# EAGLE design Driver6a (EAGLE 7.1.0)
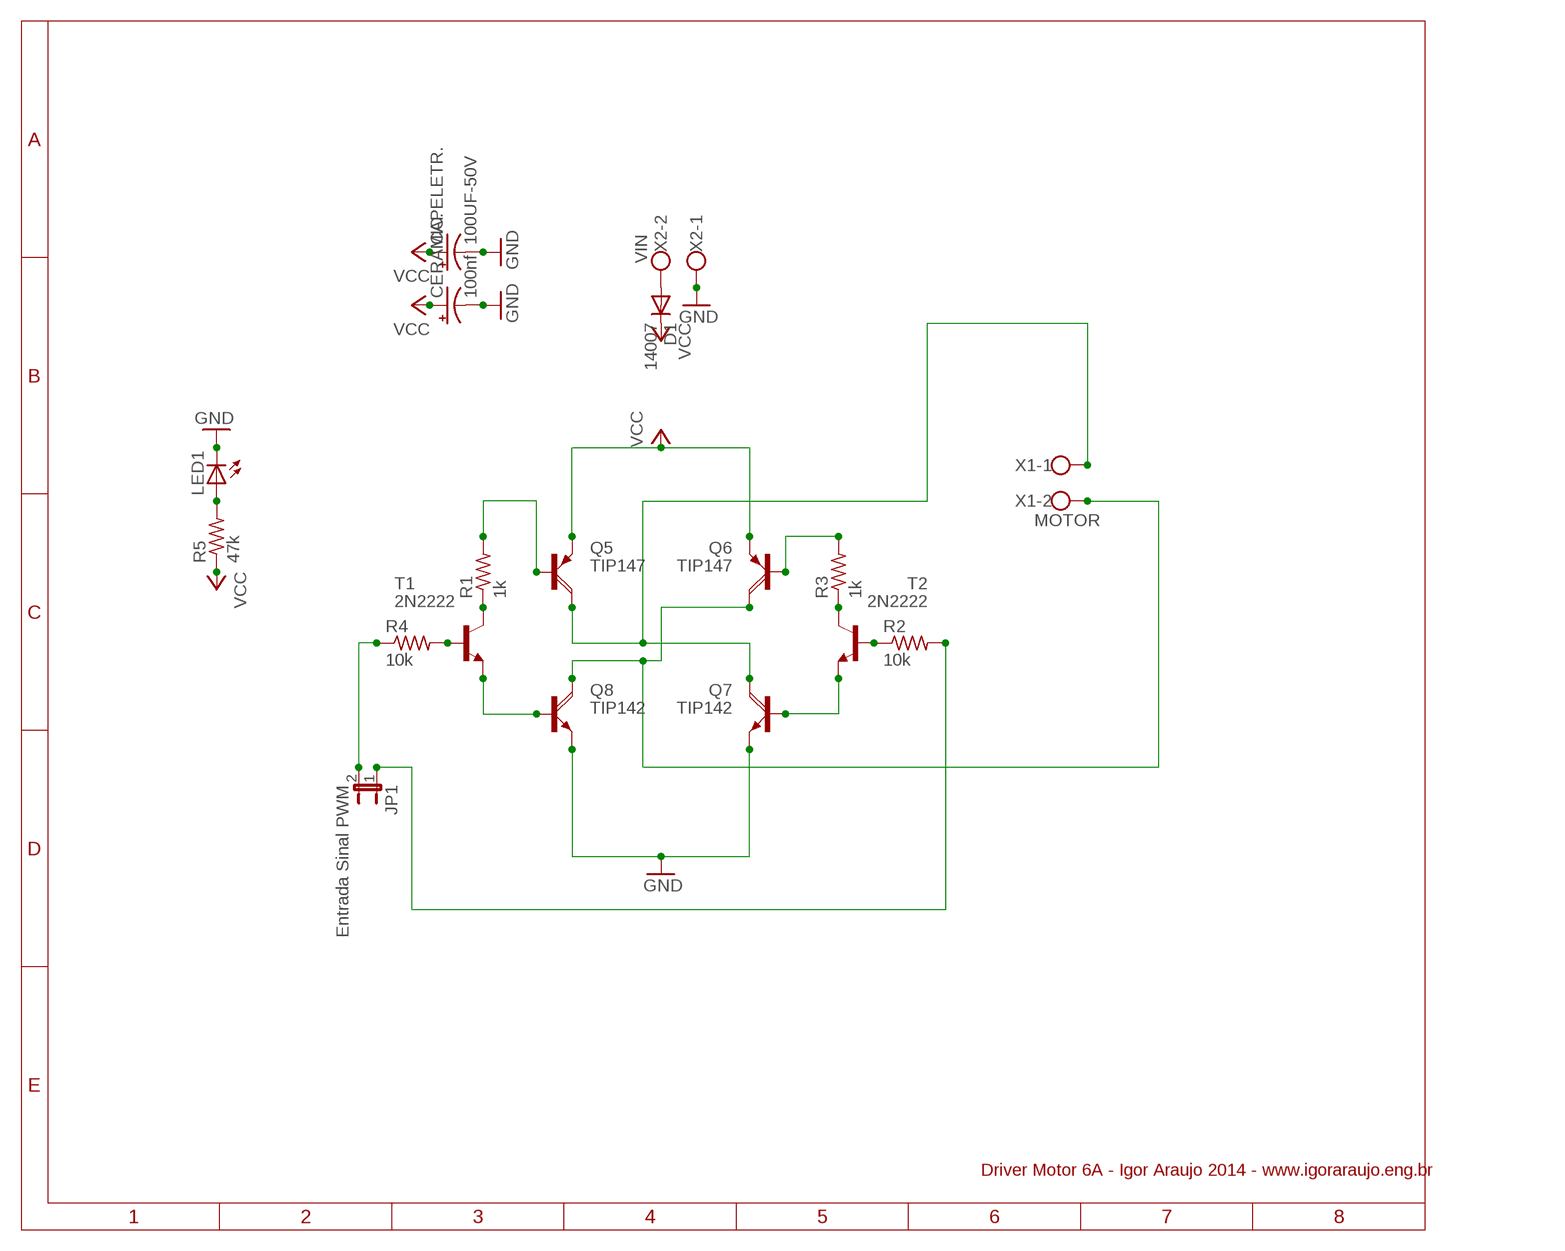
[diagram p0: schematic, sheet 1]

## Parts
CAPELETR.  100UF-50V  CPOL-USE3.5-8  [E3,5-8]
CERAMIC.  100nf  CPOL-USE3.5-8  [E3,5-8]
D1  14007  1N4148DO35-7  [DO35-7]
JP1  Entrada Sinal PWM  JP1E  [JP1]
LED1  LED3MM  [LED3MM]
Q5  TIP147  TIP125  [TO220AH]
Q6  TIP147  TIP125  [TO220AH]
Q7  TIP142  TIP120  [TO220AH]
Q8  TIP142  TIP120  [TO220AH]
R1  1k  R-US_0207/10  [0207/10]
R2  10k  R-US_0207/10  [0207/10]
R3  1k  R-US_0207/10  [0207/10]
R4  10k  R-US_0207/10  [0207/10]
R5  47k  R-US_0207/10  [0207/10]
T1  2N2222  [TO18]
T2  2N2222  [TO18]
X1  MOTOR  W237-02P  [W237-132]
X2  VIN  W237-02P  [W237-132]

## Nets
GND: CAPELETR..- CERAMIC..- LED1.K(C) Q7.E Q8.E X2.1
N$1: Q5.C Q7.C X1.1
N$2: Q6.C Q8.C X1.2
N$3: R1.1 T1.3(C)
N$4: Q5.B R1.2
N$5: Q8.B T1.1(E)
N$6: R3.1 T2.3(C)
N$7: Q6.B R3.2
N$8: Q7.B T2.1(E)
N$9: R2.1 T2.2(B)
N$10: R4.2 T1.2(B)
N$11: JP1.2 R4.1
N$12: JP1.1 R2.2
N$15: LED1.A R5.2
N$16: D1.A X2.2
VCC: CAPELETR..+ CERAMIC..+ D1.C Q5.E Q6.E R5.1

## Notes on the sheet
- Driver Motor 6A - Igor Araujo 2014 - www.igoraraujo.eng.br

## Library data of the parts
CAPELETR. CERAMIC. = rcl:CPOL-US: POLARIZED CAPACITOR, American symbol
D1 = diode:1N4148: DIODE high speed (Philips)
JP1 = jumper:JP1E: JUMPER
LED1 = led:LED: LED OSRAM: - CHIPLED LG R971, LG N971, LY N971, LG Q971, LY Q971, LO R971, LY R971 LH N974, LH R974 LS Q976, LO Q976, LY Q976 LO Q996 - Hyper CHIPLED LW Q18S LB Q993, LB Q99A, LB R99A - SideLED LS A670, LO A670, LY A670, LG A670, LP A670 LB A673, LV A673, LT A673, LW A673 LH A674 LY A675 LS A676, LA A676, LO A676, LY A676, LW A676 LS A679, LY A679, LG A679 - Hyper Micro SIDELED® LS Y876, LA Y876, LO Y876, LY Y876 LT Y87S - SmartLED LW L88C, LW L88S LB L89C, LB L89S, LG L890 LS L89K, LO L89K, LY L89K LS L896, LA L896, LO L896, LY L896 - TOPLED LS T670, LO T670, LY T670, LG T670, LP T670 LSG T670, LSP T670, LSY T670, LOP T670, LYG T670 LG T671, LOG T671, LSG T671 LB T673, LV T673, LT T673, LW T673 LH T674 LS T676, LA T676, LO T676, LY T676, LB T676, LH T676, LSB T676, LW T676 LB T67C, LV T67C, LT T67C, LS T67K, LO T67K, LY T67K, LW E67C LS E67B, LA E67B, LO E67B, LY E67B, LB E67C, LV E67C, LT E67C LW T67C LS T679, LY T679, LG T679 LS T770, LO T770, LY T770, LG T770, LP T770 LB T773, LV T773, LT T773, LW T773 LH T774 LS E675, LA E675, LY E675, LS T675 LS T776, LA T776, LO T776, LY T776, LB T776 LHGB T686 LT T68C, LB T68C - Hyper Mini TOPLED® LB M676 - Mini TOPLED Santana® LG M470 LS M47K, LO M47K, LY M47K Source: http://www.osram.convergy.de LUXEON: - LUMILED® LXK2-PW12-R00, LXK2-PW12-S00, LXK2-PW14-U00, LXK2-PW14-V00 LXK2-PM12-R00, LXK2-PM12-S00, LXK2-PM14-U00 LXK2-PE12-Q00, LXK2-PE12-R00, LXK2-PE12-S00, LXK2-PE14-T00, LXK2-PE14-U00 LXK2-PB12-K00, LXK2-PB12-L00, LXK2-PB12-M00, LXK2-PB14-N00, LXK2-PB14-P00, LXK2-PB14-Q00 LXK2-PR12-L00, LXK2-PR12-M00, LXK2-PR14-Q00, LXK2-PR14-R00 LXK2-PD12-Q00, LXK2-PD12-R00, LXK2-PD12-S00 LXK2-PH12-R00, LXK2-PH12-S00 LXK2-PL12-P00, LXK2-PL12-Q00, LXK2-PL12-R00 Source: www.luxeon.com KINGBRIGHT: KA-3528ASYC Source: www.kingbright.com
Q5 Q6 = transistor-power:TIP125: PNP DARLINGTON TRANSISTOR
Q7 Q8 = transistor-power:TIP120: NPN DARLINGTON TRANSISTOR
R1-R5 = rcl:R-US_: RESISTOR, American symbol
T1 T2 = transistor:2N2222: NPN TRANSISTOR
X1 X2 = con-wago-508:W237-02P: WAGO SREW CLAMP

## Board
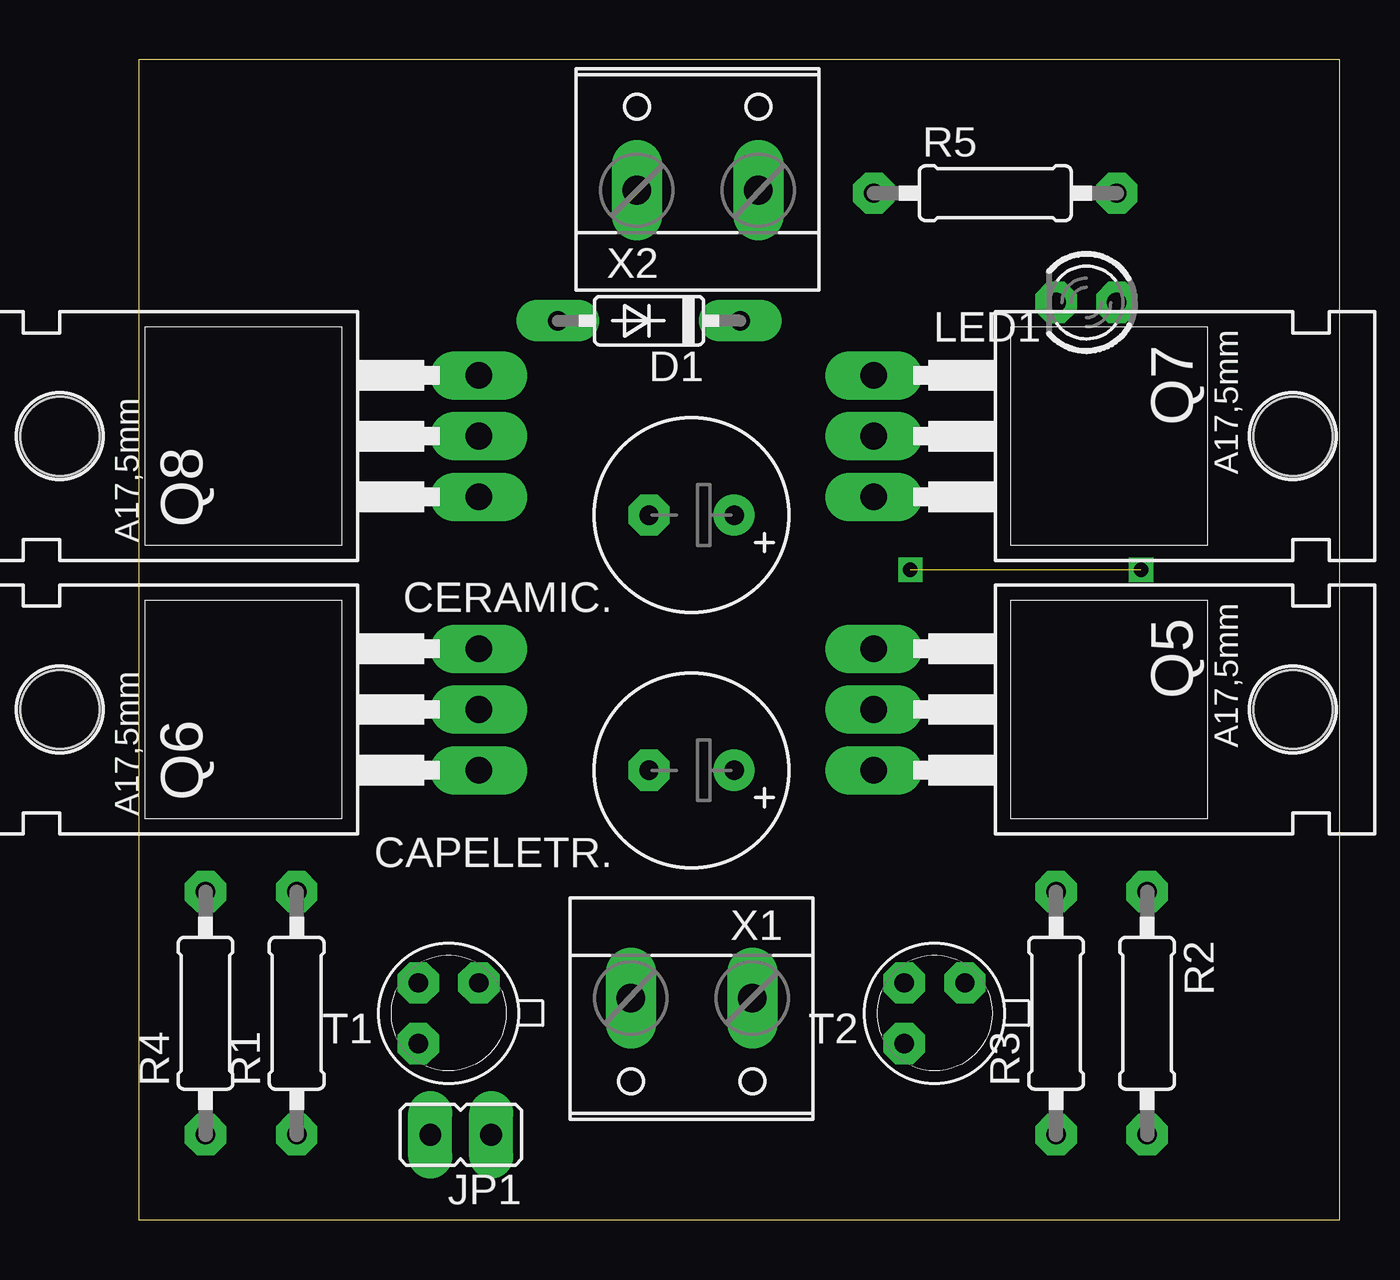
[diagram p1: board, top side]
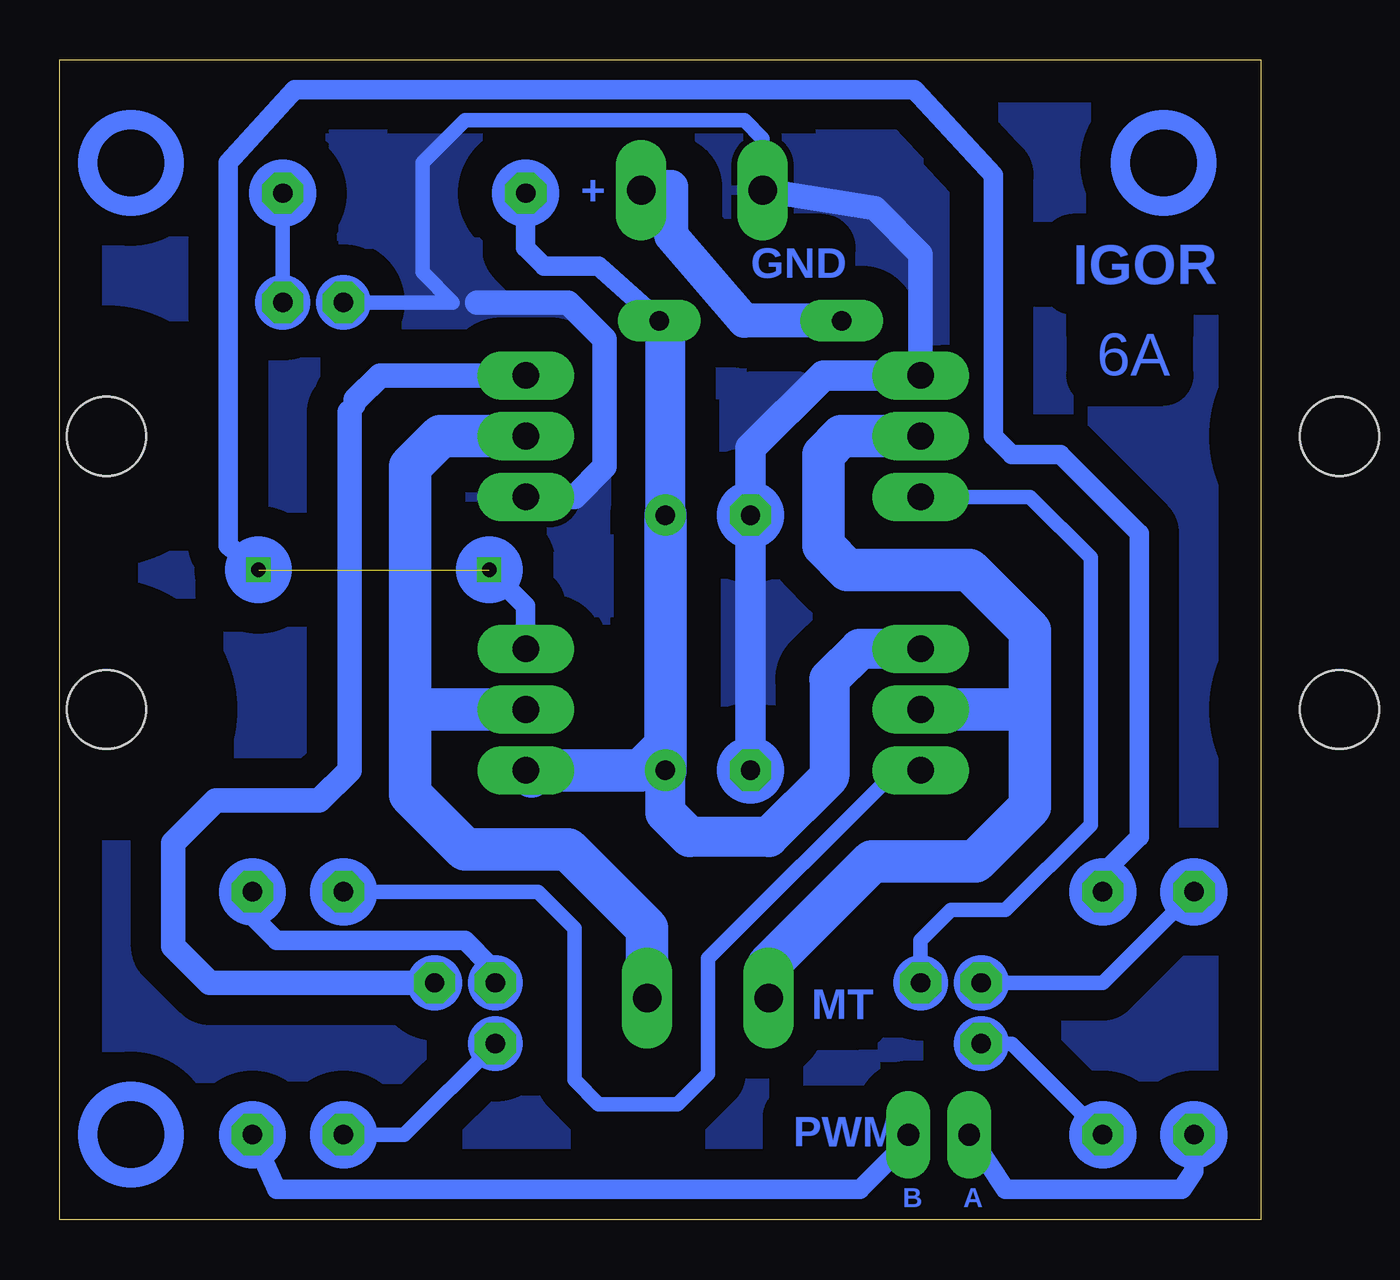
[diagram p2: board, bottom side, seen from below]

Size 50.22 x 48.5 mm. Coordinates in mm from the lower left corner, seen from the top.
Outline: 0,0 50.22,0 50.22,48.5 0,48.5 0,0
Copper layers (1*16): Top 0.035mm / dielectric 1.5mm / Bottom 0.035mm
Design rules "default *": minimum track width 24mil, minimum drill 24mil, track to track 8mil, track to pad 8mil, pad to pad 8mil, via to via 8mil, smd to smd 8mil, copper to edge 70mil, drill to drill 8mil, minimum pad ring 18mil, minimum via ring 8mil, stop-mask expansion 4mil, vias tented up to drill 0mil, thermal gap 10mil

### Footprints (pad centres in the part's own frame; a part is rotated, then mirrored left to right if it is on the bottom)
E3,5-8 = drill 0.813 pad 1.6: + -1.778,0 | drill 0.813 pad 1.6 octagon: - 1.778,0
DO35-7 = drill 0.813 long: A 3.81,0; C -3.81,0
JP1 = drill 0.914 long: 1 0,-1.27; 2 0,1.27
LED3MM = drill 0.813 octagon: A -1.27,0; K 1.27,0
TO220AH = drill 1.118 long: B -2.54,-6.35; C 0,-6.35; E 2.54,-6.35 | hole 3.302: 0,11.176
0207/10 = drill 0.813 octagon: 1 -5.08,0; 2 5.08,0
TO18 = drill 0.813 octagon: 1 -1.27,-1.27; 2 1.27,-1.27; 3 1.27,1.27
W237-132 = drill 1.194 long: 1 -2.54,-0.635; 2 2.54,-0.635

### Placement (x,y rotation side)
CAPELETR.  23.11,18.8 180 top
CERAMIC.  23.11,29.46 180 top
D1  21.34,37.59 180 top
JP1  13.46,3.56 90 top
LED1  39.62,38.35 180 top
Q5  37.08,21.34 270 top
Q6  7.87,21.34 90 top
Q7  37.08,32.77 270 top
Q8  7.87,32.77 90 top
R1  6.6,8.64 90 top
R2  42.16,8.64 270 top
R3  38.35,8.64 90 top
R4  2.79,8.64 90 top
R5  35.81,42.93 0 top
T1  12.95,8.64 180 top
T2  33.27,8.64 180 top
X1  23.11,8.64 180 top
X2  23.37,43.69 0 top

### Tracks (layer width: path | path; a pad name or v marks a point on that pad's centre or on a via)
GND
  Bottom 0.61: 28.96,30.23 Q7.E | X2.1 20.83,45.21 21.59,45.97 33.27,45.97 35.05,44.2 35.05,39.62 33.78,38.35 LED1.K
  Bottom 1.016: X2.1 16.13,42.29 14.22,40.39 Q8.E | 28.96,30.23 28.7,30.23 27.43,31.5 27.43,36.83 28.96,38.35 32.77,38.35
  Bottom 1.27: CAPELETR..- CERAMIC..- 21.34,32.26 18.29,35.31 Q8.E
  pour Bottom (isolate 1.422): 0,48.51 0,0.25 0.25,0 50.04,0 50.29,0.25 50.29,48.26 50.04,48.51
N$1
  Bottom 1.778: Q7.C 34.29,32.77 35.56,31.5 35.56,21.34 | X1.1 25.65,12.19 28.96,15.49 33.27,15.49 35.56,17.78 35.56,21.34 | 35.56,21.34 Q5.C
N$2
  Bottom 1.778: X1.2 20.57,10.67 16.26,14.99 11.94,14.99 9.65,17.27 9.65,21.34 | 9.65,21.34 9.65,24.64 12.19,27.18 17.27,27.18 18.29,28.19 18.29,32 17.53,32.77 Q8.C | 9.65,21.34 Q6.C
N$3
  Bottom 0.61: R1.1 10.41,7.37 T1.3
N$4  (via drill 0.6)  (1 unrouted)
  Bottom 0.813: Q5.B 30.73,25.65 32.26,27.18 | R1.2 6.6,14.48 5.08,16 5.08,28.7 8.38,32 10.41,32 11.18,32.77 11.18,43.69 14.48,47.24 40.39,47.24 43.18,44.2 43.18,28.19 v41.91,27.18
N$5
  Bottom 0.61: T1.1 14.22,11.68 12.95,12.95 10.67,12.95 7.11,16.51 7.11,27.69 9.65,30.23 Q8.B
N$6
  Bottom 0.61: T2.3 35.81,3.56 R3.1
N$7
  Bottom 0.61: Q6.B 15.24,18.8 23.11,10.92 23.11,6.1 24.38,4.83 27.69,4.83 28.7,5.84 28.7,12.19 30.23,13.72 R3.2
N$8
  Bottom 0.813: 37.85,34.29 37.85,34.04 38.1,33.78
  Bottom 1.016: Q7.B 36.83,35.31 37.85,34.29 | 38.1,33.78 38.1,18.8 39.37,17.53 43.69,17.53 45.47,15.75 45.47,11.43 43.94,9.91 T2.1
N$9
  Bottom 0.813: R2.1 42.16,12.7 41.15,11.68 33.27,11.68 32.26,10.67 32.26,10.16 T2.2
N$10
  Bottom 0.61: R4.2 6.6,9.91 T1.2
N$11
  Bottom 0.813: R4.1 2.79,2.03 3.3,1.27 10.67,1.27 JP1.2
N$12
  Bottom 0.813: JP1.1 14.73,3.3 16.76,1.27 41.15,1.27 R2.2
N$13  (via drill 0.6)
  other vias: 32.26,27.18
N$14
  pour Bottom (isolate 1.27): 50.29,0 0.76,0 0,0.76 0,48.01 0.51,48.51 49.53,48.51 50.29,47.75
N$15
  Bottom 0.61: LED1.A R5.2
N$16
  Bottom 1.422: 25.78,42.16 X2.2 25.78,43.18 24.64,43.18 24.64,41.15 21.59,37.59 D1.A
VCC
  Bottom 0.61: Q5.E 32,18.8
  Bottom 0.813: R5.1 30.73,40.64 29.97,39.88 27.69,39.88 D1.C
  Bottom 1.422: 24.89,37.08 D1.C
  Bottom 1.676: Q6.E 16.76,23.88 18.03,22.61 18.03,18.54 20.57,16 23.88,16 24.89,17.02 CAPELETR..+ | CERAMIC..+ 24.89,37.08
  Bottom 1.778: CERAMIC..+ CAPELETR..+ 24.89,19.81 25.91,18.8 Q5.E 30.48,18.54
(copper drawn outside any net)
  shapes: Bottom circle x33

### Text on the board
Bottom: + | IGOR | GND | 6A | MT | PWM | A | B